# Altium schematic sheet STM32F405.SchDoc
size A4; SheetNumber: 2; SheetTotal: 4
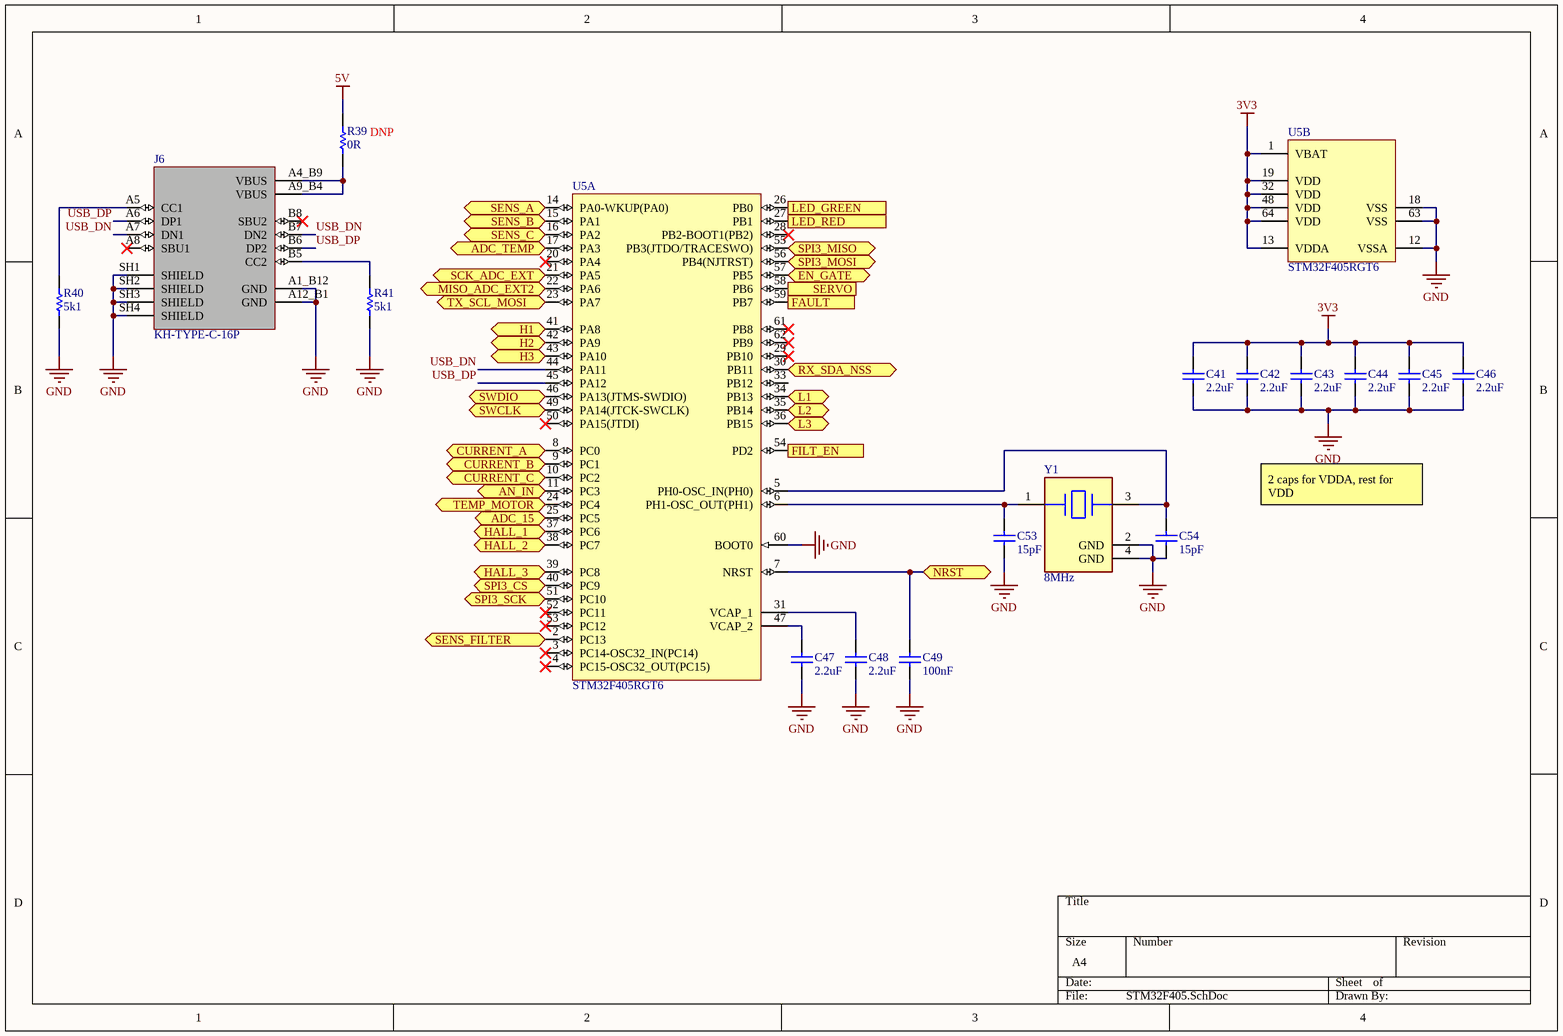
[diagram p0: STM32F405.SchDoc]

## Parts
C41  value 2.2uF  [Wurth 0603 capacitor]  (hidden comment: Generic Capacitor 2.2uF 0603)
C42  value 2.2uF  [Wurth 0603 capacitor]  (hidden comment: Generic Capacitor 2.2uF 0603)
C43  value 2.2uF  [Wurth 0603 capacitor]  (hidden comment: Generic Capacitor 2.2uF 0603)
C44  value 2.2uF  [Wurth 0603 capacitor]  (hidden comment: Generic Capacitor 2.2uF 0603)
C45  value 2.2uF  [Wurth 0603 capacitor]  (hidden comment: Generic Capacitor 2.2uF 0603)
C46  value 2.2uF  [Wurth 0603 capacitor]  (hidden comment: Generic Capacitor 2.2uF 0603)
C47  value 2.2uF  [Wurth 0603 capacitor]  (hidden comment: Generic Capacitor 2.2uF 0603)
C48  value 2.2uF  [Wurth 0603 capacitor]  (hidden comment: Generic Capacitor 2.2uF 0603)
C49  value 100nF  [Wurth 0603 capacitor]  (hidden comment: Generic Capacitor 100nF 0603)
C53  value 15pF  [Wurth 0603 capacitor]  (hidden comment: Generic Capacitor 15pF 0603)
C54  value 15pF  [Wurth 0603 capacitor]  (hidden comment: Generic Capacitor 15pF 0603)
J6  KH-TYPE-C-16P  [KINGHELM_KH-TYPE-C-16P]
R39  value 0R  [Wurth 0603 Resistor]  (hidden comment: Generic Resistor 0R 0603)
R40  value 5k1  [0805 Resistor]  (hidden comment: Generic Resistor 5k1 0805)
R41  value 5k1  [0805 Resistor]  (hidden comment: Generic Resistor 5k1 0805)
U5  STM32F405RGT6  [STM-LQFP64_M]  (parts A,B of 2)
Y1  value 8MHz  [huaxindianzi 8MHz Crystal]  (hidden comment: CF4008M00012001)

## Ports
ADC_15 (bidir), ADC_TEMP (bidir), AN_IN (bidir), CURRENT_A (bidir), CURRENT_B (bidir), CURRENT_C (bidir), EN_GATE (bidir), FAULT (in), FILT_EN (out), H1 (bidir), H2 (bidir), H3 (bidir), HALL_1 (bidir), HALL_2 (bidir), HALL_3 (bidir), L1 (bidir), L2 (bidir), L3 (bidir), LED_GREEN (out), LED_RED (out), MISO_ADC_EXT2 (bidir), NRST (bidir), RX_SDA_NSS (bidir), SCK_ADC_EXT (bidir), SENS_A (bidir), SENS_B (bidir), SENS_C (bidir), SENS_FILTER (bidir), SERVO (in), SPI3_CS (bidir), SPI3_MISO (bidir), SPI3_MOSI (bidir), SPI3_SCK (bidir), SWCLK (bidir), SWDIO (bidir), TEMP_MOTOR (bidir), TX_SCL_MOSI (bidir)

## Nets
3V3: C41.2 C42.2 C43.2 C44.2 C45.2 C46.2 U5.1(VBAT) U5.13(VDDA) U5.19(VDD) U5.32(VDD) U5.48(VDD) U5.64(VDD)
5V: R39.2
GND: C41.1 C42.1 C43.1 C44.1 C45.1 C46.1 C47.1 C48.1 C49.1 C53.1 C54.1 J6.A1_B12(GND) J6.A12_B1(GND) J6.SH1(SHIELD) J6.SH2(SHIELD) J6.SH3(SHIELD) J6.SH4(SHIELD) R40.1 R41.1 U5.12(VSSA) U5.18(VSS) U5.60(BOOT0) U5.63(VSS) Y1.2(GND) Y1.4(GND)
ADC_15: U5.25(PC5) ; port ADC_15
ADC_TEMP: U5.17(PA3) ; port ADC_TEMP
AN_IN: U5.11(PC3) ; port AN_IN
CURRENT_A: U5.8(PC0) ; port CURRENT_A
CURRENT_B: U5.9(PC1) ; port CURRENT_B
CURRENT_C: U5.10(PC2) ; port CURRENT_C
EN_GATE: U5.57(PB5) ; port EN_GATE
FAULT: U5.59(PB7) ; port FAULT
FILT_EN: U5.54(PD2) ; port FILT_EN
H1: U5.41(PA8) ; port H1
H2: U5.42(PA9) ; port H2
H3: U5.43(PA10) ; port H3
HALL_1: U5.37(PC6) ; port HALL_1
HALL_2: U5.38(PC7) ; port HALL_2
HALL_3: U5.39(PC8) ; port HALL_3
L1: U5.34(PB13) ; port L1
L2: U5.35(PB14) ; port L2
L3: U5.36(PB15) ; port L3
LED_GREEN: U5.26(PB0) ; port LED_GREEN
LED_RED: U5.27(PB1) ; port LED_RED
MISO_ADC_EXT2: U5.22(PA6) ; port MISO_ADC_EXT2
NRST: C49.2 U5.7(NRST) ; port NRST
RX_SDA_NSS: U5.30(PB11) ; port RX_SDA_NSS
SCK_ADC_EXT: U5.21(PA5) ; port SCK_ADC_EXT
SENS_A: U5.14(PA0-WKUP(PA0)) ; port SENS_A
SENS_B: U5.15(PA1) ; port SENS_B
SENS_C: U5.16(PA2) ; port SENS_C
SENS_FILTER: U5.2(PC13) ; port SENS_FILTER
SERVO: U5.58(PB6) ; port SERVO
SPI3_CS: U5.40(PC9) ; port SPI3_CS
SPI3_MISO: U5.55(PB3(JTDO/TRACESWO)) ; port SPI3_MISO
SPI3_MOSI: U5.56(PB4(NJTRST)) ; port SPI3_MOSI
SPI3_SCK: U5.51(PC10) ; port SPI3_SCK
SWCLK: U5.49(PA14(JTCK-SWCLK)) ; port SWCLK
SWDIO: U5.46(PA13(JTMS-SWDIO)) ; port SWDIO
TEMP_MOTOR: U5.24(PC4) ; port TEMP_MOTOR
TX_SCL_MOSI: U5.23(PA7) ; port TX_SCL_MOSI
USB_DN: J6.A7(DN1) J6.B7(DN2) U5.44(PA11)
USB_DP: J6.A6(DP1) J6.B6(DP2) U5.45(PA12)
NetC47_2: C47.2 U5.47(VCAP_2)
NetC48_2: C48.2 U5.31(VCAP_1)
NetC53_2: C53.2 U5.6(PH1-OSC_OUT(PH1)) Y1.1
NetC54_2: C54.2 U5.5(PH0-OSC_IN(PH0)) Y1.3
NetJ6_A4_B9: J6.A4_B9(VBUS) J6.A9_B4(VBUS) R39.1
NetJ6_A5: J6.A5(CC1) R40.2
NetJ6_B5: J6.B5(CC2) R41.2

Not connected (* = marked no-connect by the designer): J6 A8(SBU1)* B8(SBU2)*; U5 3(PC14-OSC32_IN(PC14))* 4(PC15-OSC32_OUT(PC15))* 20(PA4)* 28(PB2-BOOT1(PB2))* 29(PB10)* 33(PB12) 50(PA15(JTDI))* 52(PC11)* 53(PC12)* 61(PB8)* 62(PB9)*

## Notes on the sheet
- (near R39) DNP
- 2 caps for VDDA, rest for VDD

## Library data of the parts
J6 = KH-TYPE-C-16P: MF: kinghelm; Value: *; SnapEDA_Link: https://www.snapeda.com/parts/KH-TYPE-C-16P/Ki/view-part/?ref=snap; MP: KH-TYPE-C-16P; Check_prices: https://www.snapeda.com/parts/KH-TYPE-C-16P/Ki/view-part/?ref=eda; Availability: Not in stock; Price: None; Package: None
U5 = CMP-0243-00019-3: ARM Cortex-M4 32-bit MCU+FPU, 210 DMIPS, 1024 kB Flash, 192 kB Internal RAM, 51 I/Os, 64-pin LQFP, -40 to 85 degC, Tray; Manufacturer: STMicroelectronics; Supply Voltage(Vcc) min (V): 1.8; Supply Voltage(Vcc) max (V): 3.6; Internal RAM Size (kB): 192; I/Os (High Current): 51; D/A Converter: 2x12-bit; FLASH Size (Prog) (kB): 1024; Operating Frequency(F) (Processor speed) (MHz): 168; ComponentLink2Description: Datasheet; PackageVersion: Rev. 4, 06/2013; DatasheetVersion: Rev. 4; Core: ARM Cortex-M4; ComponentLink2URL: http://www.st.com/st-web-ui/static/active/en/resource/technical/document/datasheet/DM00037051.pdf; PackageReference: LQFP64; Packing: Tray; ComponentLink1Description: Manufacturer URL; ComponentLink3URL: http://www.st.com/st-web-ui/static/active/en/resource/technical/document/datasheet/DM00037051.pdf; ComponentLink3Description: Package Specification; Mounting Technology: Surface Mount; ComponentLink1URL: http://www.st.com/web/en/home.html; PackageDescription: 64-Pin Low Profile Quad Flat Package, 10 x 10 mm Body, 0.5 mm Pitch; PartNumber: STM32F405RGT6
Y1 = 8MHz huaxindianzi Crystal